# EasyEDA schematic table3.json
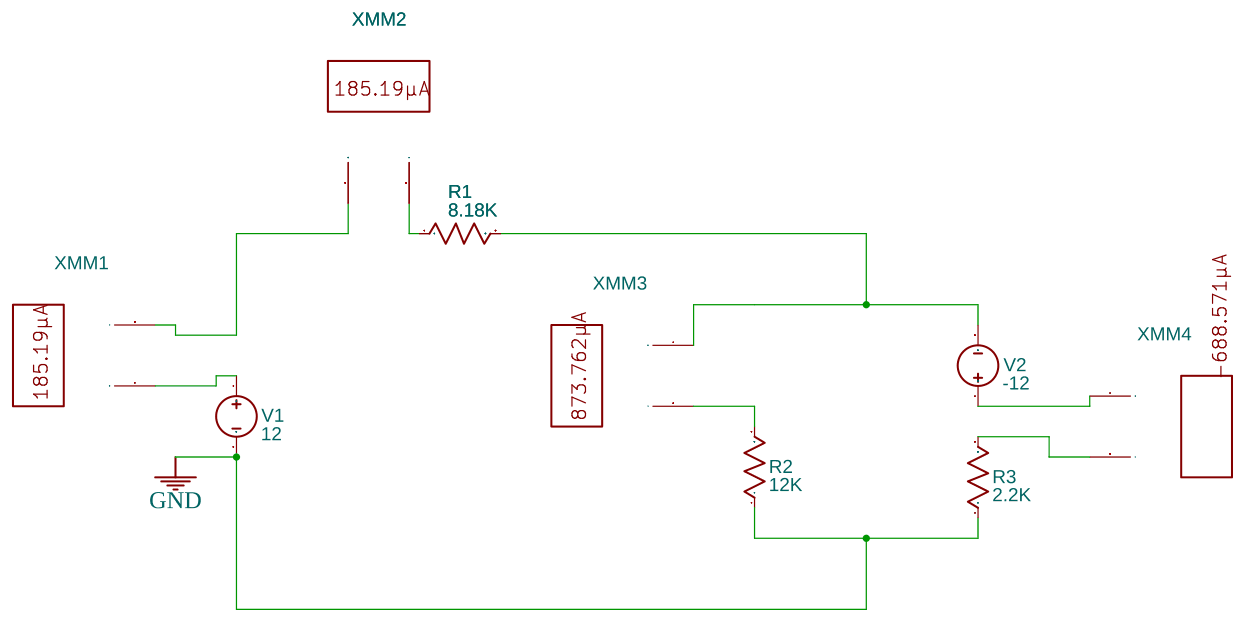
[diagram p0: schematic sheet]

## Parts
R1  8.18K  [AXIAL-0.3]
R2  12K  [AXIAL-0.3]
R3  2.2K  [AXIAL-0.3]
V1  12  [HDR1X2]
V2  -12  [HDR1X2]
XMM1  Multimeter
XMM2  Multimeter
XMM3  Multimeter
XMM4  Multimeter

## Library data of the parts
R1-R3 = Resistor_US: Resistance: 1k; Contributor: EasyEDA; Supplier: YUJING
V1 V2 = VDC: Contributor: EasyEDA; sim: true
XMM1-XMM4 = MULTIMETER: Supplier: LCSC; Multimeter Type: Amper; Power Type: AC; Voltmeter resistance: 10μ; Ammeter resistance: 1G; NameDisplay: 0; Contributor: EasyEDA; sim: true

## Nets
GND: R2.1 R3.1 V1.2
Net-(R1-1): R1.1 XMM2.2(I)
Net-(R1-2): R1.2 V2.2 XMM3.1(+)
Net-(R2-2): R2.2 XMM3.2(I)
Net-(R3-2): R3.2 XMM4.2(I)
Net-(V1-1): V1.1 XMM1.1(+)
Net-(V2-1): V2.1 XMM4.1(+)
Net-(XMM1-2): XMM1.2(I) XMM2.1(+)
